# Altium schematic sheet PCB_traces_vias.SchDoc: Trace width design
size A4; SheetNumber: 4; SheetTotal: 20; TitleBig: Trace & via characteristics; Desc_line1: Trace width based on results from PCB Toolkit by Saturn PCB Design INC.; Desc_line2: Used JLCPCB 2-layer, FR-4, 1.6 mm height, 35 um conductor height (1 oz/ft^2) board characteristics as reference.
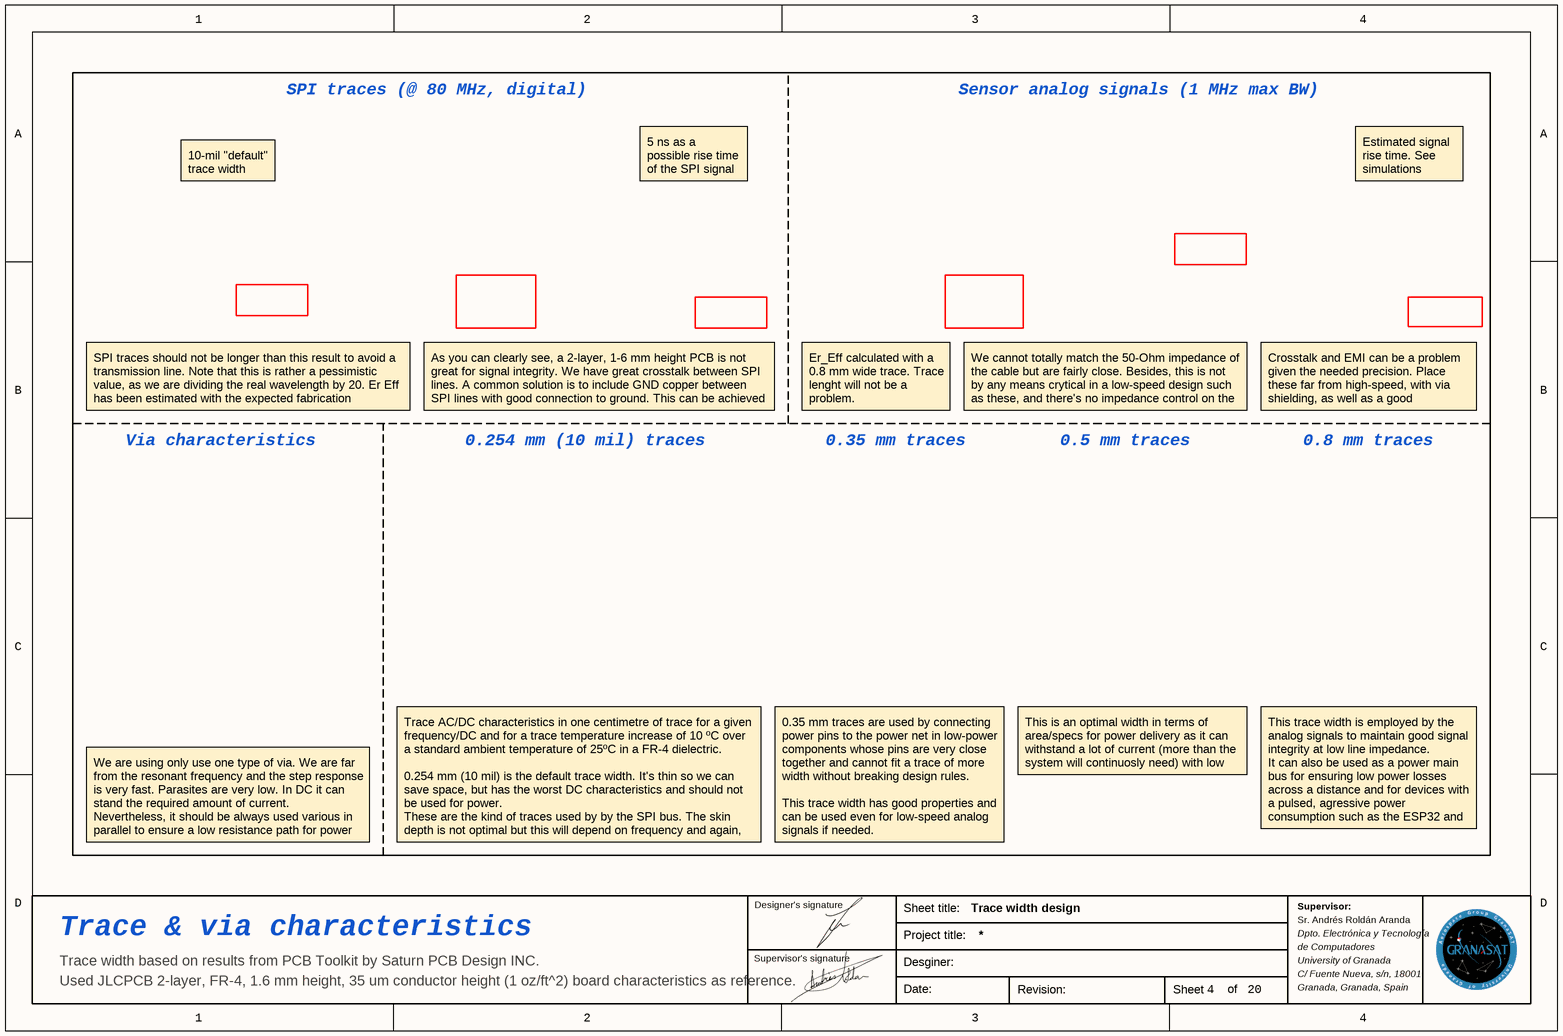
[diagram p0: PCB_traces_vias.SchDoc]

## Notes on the sheet
- SPI traces (@ 80 MHz, digital)
- Sensor analog signals (1 MHz max BW)
- 10-mil "default" trace width
- 5 ns as a possible rise time of the SPI signal
- Estimated signal rise time. See simulations
- SPI traces should not be longer than this result to avoid a transmission line. Note that this is rather a pessimistic value, as we are dividing the real wavelength by 20. Er Eff has been estimated with the expected fabrication characteristics.
- Via characteristics
- As you can clearly see, a 2-layer, 1-6 mm height PCB is not great for signal integrity. We have great crosstalk between SPI lines. A common solution is to include GND copper between SPI lines with good connection to ground. This can be achieved by using via shielding.
- 0.254 mm (10 mil) traces
- Er_Eff calculated with a 0.8 mm wide trace. Trace lenght will not be a problem.
- 0.35 mm traces
- We cannot totally match the 50-Ohm impedance of the cable but are fairly close. Besides, this is not by any means crytical in a low-speed design such as these, and there's no impedance control on the end of the lines
- 0.5 mm traces
- Crosstalk and EMI can be a problem given the needed precision. Place these far from high-speed, with via shielding, as well as a good GND/power planes below.
- 0.8 mm traces
- This is an optimal width in terms of area/specs for power delivery as it can withstand a lot of current (more than the system will continuosly need) with low losses.
- We are using only use one type of via. We are far from the resonant frequency and the step response is very fast. Parasites are very low. In DC it can stand the required amount of current. Nevertheless, it should be always used various in parallel to ensure a low resistance path for power and returning currents.
- Trace AC/DC characteristics in one centimetre of trace for a given frequency/DC and for a trace temperature increase of 10 ºC over a standard ambient temperature of 25ºC in a FR-4 dielectric.
  0.254 mm (10 mil) is the default trace width. It's thin so we can save space, but has the worst DC characteristics and should not be used for power.
  These are the kind of traces used by by the SPI bus. The skin depth is not optimal but this will depend on frequency and again, AC current is not a crytical aspect here. It's a "good enough" approach.
- 0.35 mm traces are used by connecting power pins to the power net in low-power components whose pins are very close together and cannot fit a trace of more width without breaking design rules.
  This trace width has good properties and can be used even for low-speed analog signals if needed.
- This trace width is employed by the analog signals to maintain good signal integrity at low line impedance.
  It can also be used as a power main bus for ensuring low power losses across a distance and for devices with a pulsed, agressive power consumption such as the ESP32 and the LCD.
- Designer's signature
- Sheet title:
- Sr. Andrés Roldán Aranda
- Supervisor:
- Supervisor's signature
- Project title:
- Desginer:
- Dpto. Electrónica y Tecnología
- de Computadores
- University of Granada
- C/ Fuente Nueva, s/n, 18001
- Granada, Granada, Spain
- Date:
- Revision:
- Sheet
- of